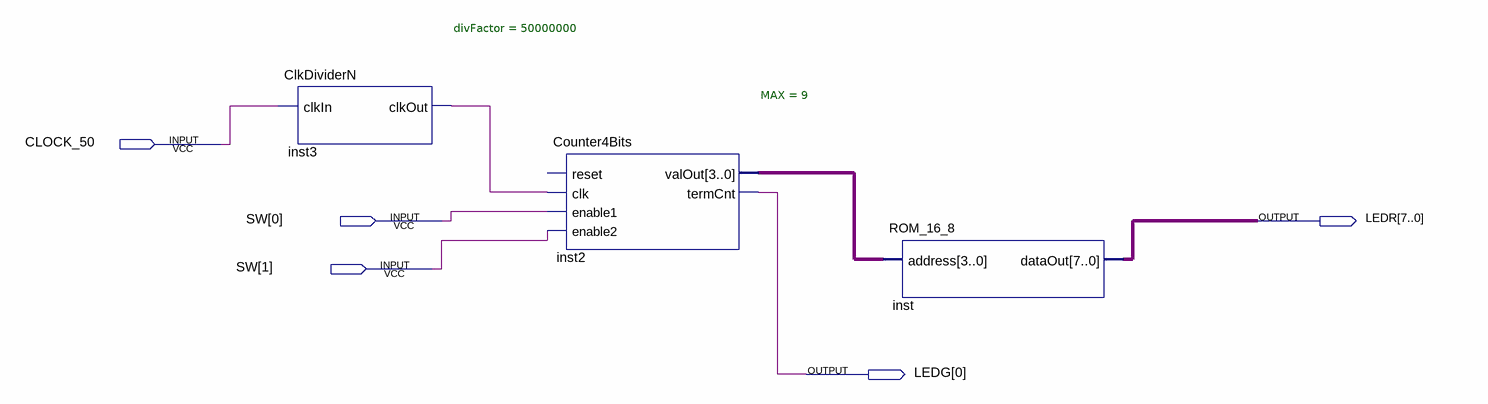
[diagram p0: schematic sheet]
// Quartus schematic ROM_Demo.bdf as structural Verilog: 3 symbols, 5 pins
module ROM_Demo (
  input  CLOCK_50,
  input  [1:0] SW,
  output [7:0] LEDR,
  output [0:0] LEDG
);

  wire inst3_clkout;
  wire [3:0] inst2_valout;

  ClkDividerN #(.divFactor(50000000)) inst3 (.clkIn(CLOCK_50), .clkOut(inst3_clkout));
  Counter4Bits #(.MAX(9)) inst2 (
    .clk(inst3_clkout), .enable1(SW[0]), .enable2(SW[1]), .valOut(inst2_valout), .termCnt(LEDG[0]));  // open: reset
  ROM_16_8 inst (.address(inst2_valout), .dataOut(LEDR));
endmodule
